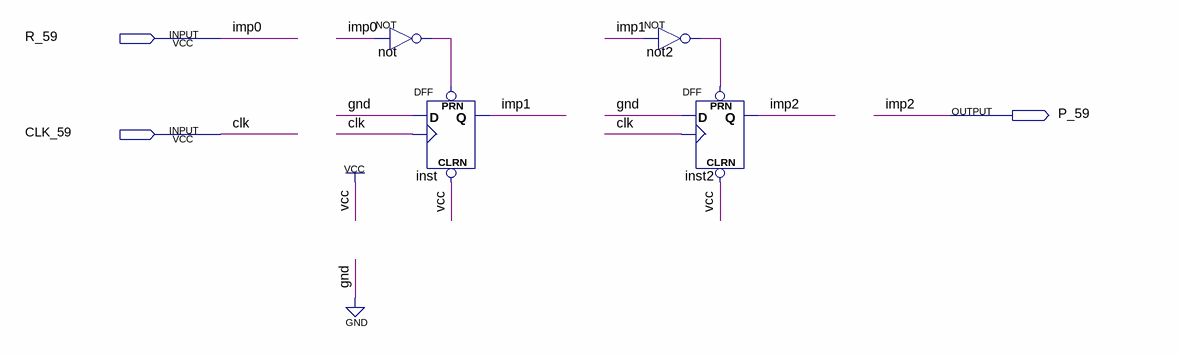
[diagram p0: schematic sheet]
// Quartus schematic stb2_59.bdf as structural Verilog: 4 symbols, 3 pins
module stb2_59 (
  input  R_59,
  input  CLK_59,
  output P_59
);

  wire imp1, not2_out, not_out;

  not \not  (not_out, R_59);
  DFF inst (.CLRN(1'b1), .CLK(CLK_59), .D(1'b0), .PRN(not_out), .Q(imp1));
  not not2 (not2_out, imp1);
  DFF inst2 (.CLRN(1'b1), .CLK(CLK_59), .D(1'b0), .PRN(not2_out), .Q(P_59));

  // Other names for the same wires on the sheet: clk = CLK_59; imp0 = R_59; imp2 = P_59
endmodule
